# EAGLE design main (EAGLE 9.0.0)
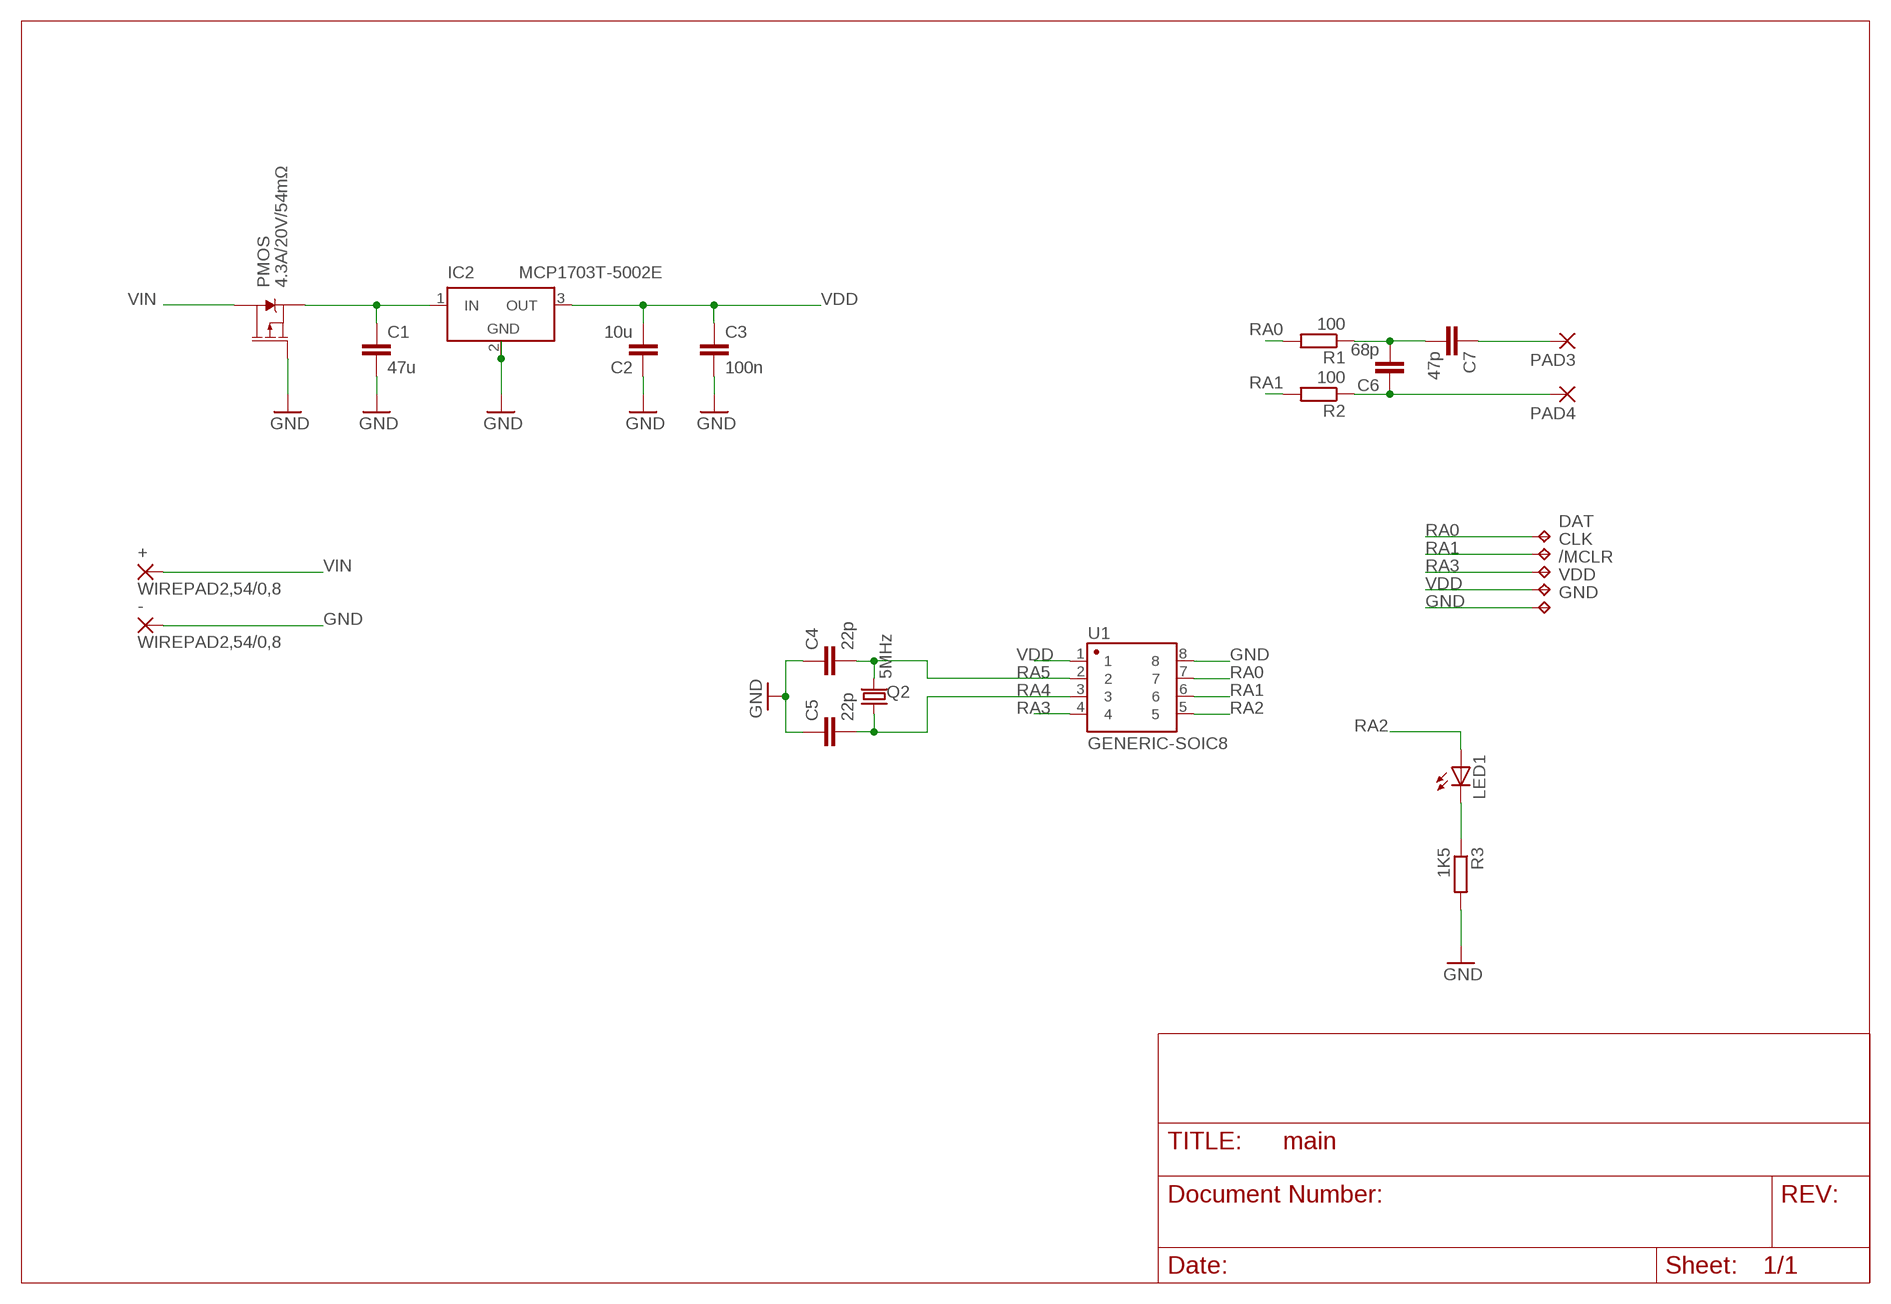
[diagram p0: schematic, sheet 1]

## Parts
+  WIREPAD2,54/0,8  [2,54/0,8]
-  WIREPAD2,54/0,8  [2,54/0,8]
/MCLR  TPTP08SQ  [TP08SQ]
C1  47u  C-EUC1206  [C1206]
C2  10u  C-EUC1206  [C1206]
C3  100n  C-EUC0603  [C0603]
C4  22p  C-EUC0603  [C0603]
C5  22p  C-EUC0603  [C0603]
C6  68p  C-EUC0603  [C0603]
C7  47p  C-EUC0603  [C0603]
CLK  TPTP08SQ  [TP08SQ]
DAT  TPTP08SQ  [TP08SQ]
GND  TPTP08SQ  [TP08SQ]
IC2  MCP1703T-5002E  LT1129CST5  [SOT223]
LED1  LEDCHIP-LED0603  [CHIP-LED0603]
PAD3  1,6/0,9  [1,6/0,9]
PAD4  1,6/0,9  [1,6/0,9]
PMOS  4.3A/20V/54mΩ  MOSFET_PCH-IRLML2244  [SOT23-3]
Q2  5MHz  CRYSTALHC49UP  [HC49UP]
R1  100  R-EU_R0603  [R0603]
R2  100  R-EU_R0603  [R0603]
R3  1K5  R-EU_R0603  [R0603]
U1  GENERIC-SOIC8  [SO08-UNIVERSAL]
VDD  TPTP08SQ  [TP08SQ]

## Nets
GND: -.1(P) C1.2 C2.1 C3.2 C4.1 C5.1 GND.TP IC2.2(GND) PMOS.1(G) R3.2 U1.8
N$1: C1.1 IC2.1(IN) PMOS.2(S)
N$2: C6.2 C7.2 R1.1
N$3: C6.1 PAD4.1(P) R2.1
N$5: LED1.C R3.1
N$6: C7.1 PAD3.1(P)
RA0: DAT.TP R1.2 U1.7
RA1: CLK.TP R2.2 U1.6
RA2: LED1.A U1.5
RA3: /MCLR.TP U1.4
RA4: C5.2 Q2.1 U1.3
RA5: C4.2 Q2.2 U1.2
VDD: C2.2 C3.1 IC2.3(OUT) U1.1 VDD.TP
VIN: +.1(P) PMOS.3(D)

## Power pins joined to a net without a drawn wire
GND: IC2.4(GND)

## Library data of the parts
+ - = wirepad:WIREPAD: Wire PAD connect wire on PCB
/MCLR CLK DAT GND VDD = testpad:TP: Test pad
C1-C7 = rcl:C-EU: CAPACITOR, European symbol; SPICEPREFIX: C
IC2 = linear-technology:LT1129CST5: VOLTAGE REGULATOR with shutdown; MPN: LT1129CST-5#PBF; OC_FARNELL: 1663375; OC_NEWARK: 57M2069
LED1 = led:LED: LED OSRAM: - CHIPLED LG R971, LG N971, LY N971, LG Q971, LY Q971, LO R971, LY R971 LH N974, LH R974 LS Q976, LO Q976, LY Q976 LO Q996 - Hyper CHIPLED LW Q18S LB Q993, LB Q99A, LB R99A - SideLED LS A670, LO A670, LY A670, LG A670, LP A670 LB A673, LV A673, LT A673, LW A673 LH A674 LY A675 LS A676, LA A676, LO A676, LY A676, LW A676 LS A679, LY A679, LG A679 - Hyper Micro SIDELED® LS Y876, LA Y876, LO Y876, LY Y876 LT Y87S - SmartLED LW L88C, LW L88S LB L89C, LB L89S, LG L890 LS L89K, LO L89K, LY L89K LS L896, LA L896, LO L896, LY L896 - TOPLED LS T670, LO T670, LY T670, LG T670, LP T670 LSG T670, LSP T670, LSY T670, LOP T670, LYG T670 LG T671, LOG T671, LSG T671 LB T673, LV T673, LT T673, LW T673 LH T674 LS T676, LA T676, LO T676, LY T676, LB T676, LH T676, LSB T676, LW T676 LB T67C, LV T67C, LT T67C, LS T67K, LO T67K, LY T67K, LW E67C LS E67B, LA E67B, LO E67B, LY E67B, LB E67C, LV E67C, LT E67C LW T67C LS T679, LY T679, LG T679 LS T770, LO T770, LY T770, LG T770, LP T770 LB T773, LV T773, LT T773, LW T773 LH T774 LS E675, LA E675, LY E675, LS T675 LS T776, LA T776, LO T776, LY T776, LB T776 LHGB T686 LT T68C, LB T68C - Hyper Mini TOPLED® LB M676 - Mini TOPLED Santana® LG M470 LS M47K, LO M47K, LY M47K Source: http://www.osram.convergy.de LUXEON: - LUMILED® LXK2-PW12-R00, LXK2-PW12-S00, LXK2-PW14-U00, LXK2-PW14-V00 LXK2-PM12-R00, LXK2-PM12-S00, LXK2-PM14-U00 LXK2-PE12-Q00, LXK2-PE12-R00, LXK2-PE12-S00, LXK2-PE14-T00, LXK2-PE14-U00 LXK2-PB12-K00, LXK2-PB12-L00, LXK2-PB12-M00, LXK2-PB14-N00, LXK2-PB14-P00, LXK2-PB14-Q00 LXK2-PR12-L00, LXK2-PR12-M00, LXK2-PR14-Q00, LXK2-PR14-R00 LXK2-PD12-Q00, LXK2-PD12-R00, LXK2-PD12-S00 LXK2-PH12-R00, LXK2-PH12-S00 LXK2-PL12-P00, LXK2-PL12-Q00, LXK2-PL12-R00 Source: www.luxeon.com KINGBRIGHT: KA-3528ASYC Source: www.kingbright.com
PAD3 PAD4 = wirepad:1,6/0,9: THROUGH-HOLE PAD
PMOS = SparkFun-DiscreteSemi:MOSFET_PCH: P-channel MOSFETs Voltage controlled devices that allow control of high current outputs. SparkFun Products: SparkFun ESP32 Thing <https://www.sparkfun.com/products/13907> SparkFun ESP8266 Thing <https://www.sparkfun.com/products/13231>; PROD_ID: TRANS-11153
Q2 = adafruit:CRYSTAL: CRYSTAL; OC_FARNELL: unknown; OC_NEWARK: unknown
R1-R3 = rcl:R-EU_: RESISTOR, European symbol; SPICEPREFIX: R
U1 = SparkFun-Retired:GENERIC-SOIC8: A placeholder for generic narrow & wide SOIC8 foorptints - used on the DIP adapter board. Has strange reference to IC-10141, a Seven Band Graphic Equalizer Display Filter SOIC-8 VFP: IC-10141

## Board
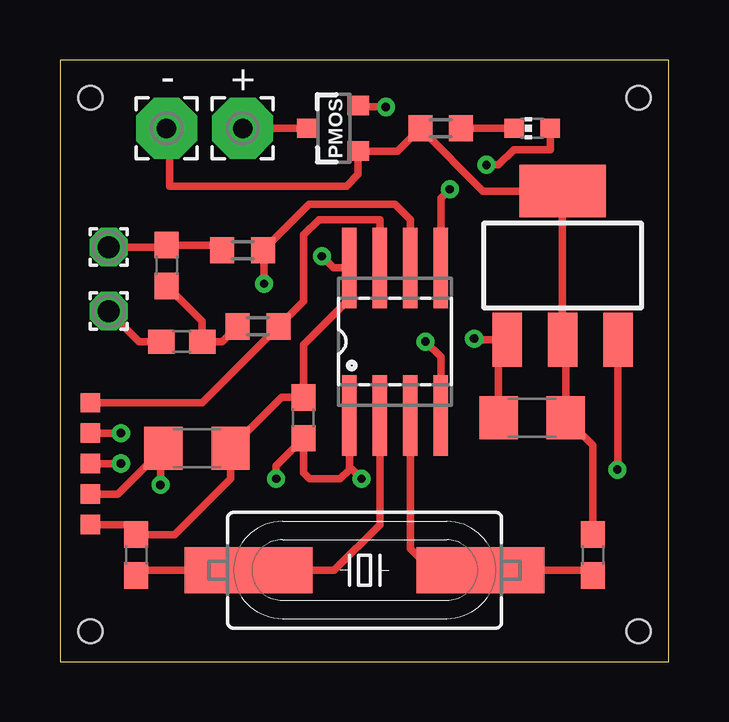
[diagram p1: board, top side]
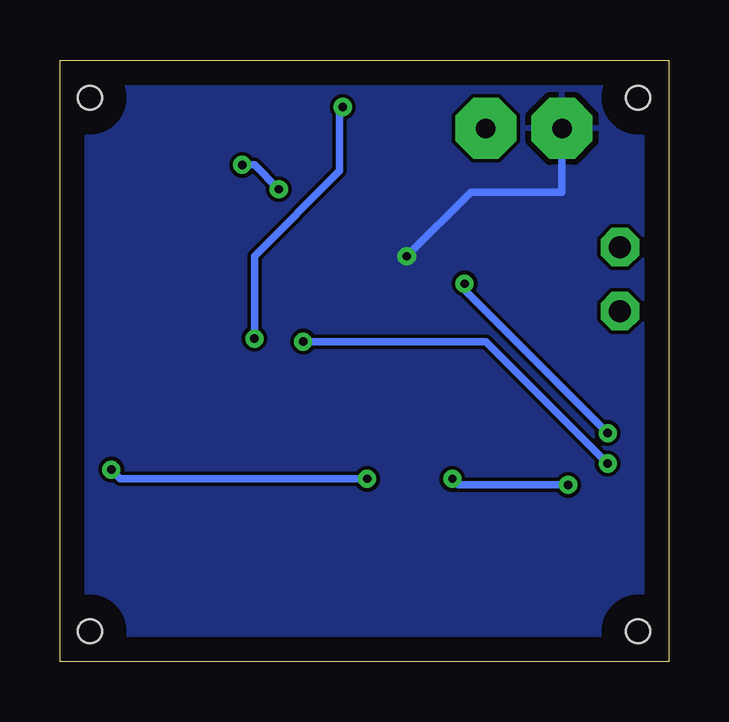
[diagram p2: board, bottom side, seen from below]

Size 25.38 x 25.07 mm. Coordinates in mm from the lower left corner, seen from the top.
Outline: 0,0 25.38,0 25.38,25.07 0,25.07 0,0
Copper layers (1*16): Top 0.035mm / dielectric 1.5mm / Bottom 0.035mm
Design rules "default": minimum track width 6mil, minimum drill 0.35mm, track to track 6mil, track to pad 6mil, pad to pad 6mil, via to via 6mil, smd to smd 6mil, copper to edge 40mil, drill to drill 6mil, minimum pad ring 10mil, minimum via ring 8mil, stop-mask expansion 4mil, vias tented up to drill 0mil, thermal gap 10mil
Holes 1 mm at 1.27,23.5 24.13,23.5 24.13,1.27 1.27,1.27

### Footprints (pad centres in the part's own frame; a part is rotated, then mirrored left to right if it is on the bottom)
2,54/0,8 = drill 0.813 pad 2.54 octagon: 1 0,0
TP08SQ = smd 0.8 x 0.8: TP 0,0
C1206 = smd 1.6 x 1.8: 1 -1.4,0; 2 1.4,0
C0603 = smd 1.1 x 1: 1 -0.85,0; 2 0.85,0
SOT223 = smd 1.219 x 2.235: 1 -2.311,-3.099; 2 0,-3.099; 3 2.311,-3.099 | smd 3.6 x 2.2: 4 0,3.099
CHIP-LED0603 = smd 0.8 x 0.8: A 0,-0.75; C 0,0.75
1,6/0,9 = drill 0.914 pad 1.6 octagon: 1 0,0
SOT23-3 = smd 0.8 x 0.9: 1 -0.95,-1; 2 0.95,-1; 3 0,1.1
HC49UP = smd 5.334 x 1.93: 1 -4.826,0; 2 4.826,0
R0603 = smd 1 x 1.1: 1 -0.85,0; 2 0.85,0
SO08-UNIVERSAL = smd 0.61 x 3.353: 1 -1.905,-3.073; 2 -0.635,-3.073; 3 0.635,-3.073; 4 1.905,-3.073; 5 1.905,3.073; 6 0.635,3.073; 7 -0.635,3.073; 8 -1.905,3.073

### Placement (x,y rotation side)
+  7.62,22.23 0 top
-  4.45,22.23 0 top
/MCLR  1.27,8.26 0 top
C1  19.68,10.16 0 top
C2  5.71,8.89 180 top
C3  10.16,10.16 90 top
C4  3.17,4.45 270 top
C5  22.23,4.45 270 top
C6  4.45,16.51 270 top
C7  5.08,13.34 0 top
CLK  1.27,9.53 0 top
DAT  1.27,10.79 0 top
GND  1.27,5.71 0 top
IC2  20.95,16.51 0 top
LED1  19.68,22.23 90 top
PAD3  2.03,14.61 0 top
PAD4  2.03,17.27 0 top
PMOS  11.43,22.23 90 top
Q2  12.7,3.81 180 top
R1  8.26,13.97 0 top
R2  7.62,17.14 0 top
R3  15.88,22.23 180 top
U1  13.97,13.34 0 top
VDD  1.27,6.99 0 top

### Tracks (layer width: path | path; a pad name or v marks a point on that pad's centre or on a via)
GND  (via drill 0.35)
  Top 0.305: GND.TP 2.75,5.71 C4.1 4.79,5.29 7.12,7.62 C2.1 9.23,11.01 C3.2 10.16,13.21 12.06,15.11 U1.8 11.4,16.41 v10.92,16.89 | C5.1 22.23,9.02 C1.2 21.09,13.28 IC2.2 IC2.4 17.64,19.61 R3.2 14.07,21.27 PMOS.1 12.43,20.3 11.94,19.81 4.57,19.81 4.57,22.1 -.1
  Bottom 0.305: v10.92,16.89 8.26,19.56 4.45,19.56 -.1
  pour Bottom: -0.64,0 -0.64,24.77 0,25.4 26.04,25.4 26.04,-0.64 0,-0.64
N$1  (via drill 0.35)
  Top 0.305: C1.1 18.29,13.05 IC2.1 17.32,13.41 v17.27,13.46 | PMOS.2 12.49,23.11 v13.59,23.11
  Bottom 0.305: v13.59,23.11 13.72,22.99 13.72,20.45 17.27,16.89 v17.27,13.46
N$2
  Top 0.305: C6.2 5.93,14.18 C7.2 6.77,13.34 R1.1
N$3
  Top 0.305: 4.23,17.14 C6.1 | C6.1 6.55,17.36 R2.1 | C6.1 4.36,17.27 PAD4.1
N$5
  Top 0.305: R3.1 LED1.C
N$6
  Top 0.305: C7.1 3.3,13.34 PAD3.1
RA0
  Top 0.305: U1.7 13.34,18.41 10.79,18.41 10.16,17.78 10.16,15.03 R1.2 5.93,10.79 DAT.TP
RA1  (via drill 0.35)
  Top 0.305: U1.6 14.61,18.41 13.97,19.05 10.38,19.05 R2.2 8.51,17.11 v8.51,15.75 | CLK.TP v2.54,9.53
  Bottom 0.305: v2.54,9.53 8.51,15.49 v8.51,15.75
RA2  (via drill 0.35)
  Top 0.305: U1.5 15.88,19.3 v16.26,19.68 | v17.78,20.7 18.29,20.7 18.92,21.34 20.45,21.34 20.45,22.21 LED1.A
  Bottom 0.305: v16.26,19.68 17.27,20.7 v17.78,20.7
RA3  (via drill 0.35)
  Top 0.305: U1.4 15.88,12.7 v15.24,13.34 | v2.54,8.26 /MCLR.TP
  Bottom 0.305: v15.24,13.34 7.62,13.34 v2.54,8.26
RA4
  Top 0.305: U1.3 14.61,4.7 15.49,3.81 Q2.1 22.01,3.81 C5.2
RA5
  Top 0.305: U1.2 13.34,5.71 11.43,3.81 Q2.2 3.39,3.81 C4.2
VDD  (via drill 0.35)
  Top 0.305: VDD.TP 2.41,6.99 C2.2 4.19,8.77 v4.19,7.37 | 12.06,8.13 12.06,8 11.68,7.62 10.41,7.62 10.16,7.87 C3.1 9.02,8.17 v9.02,7.62 | 12.06,8.13 U1.1 | IC2.3 23.27,8.03 v23.24,8 | v12.57,7.62 12.06,8.13
  Bottom 0.305: v23.24,8 22.86,7.62 v12.57,7.62 | v9.02,7.62 8.76,7.37 v4.19,7.37
VIN
  Top 0.305: +.1 PMOS.3